# EAGLE design Cass2SD (EAGLE 8.3.1)
AUTOR: Bernd Strobel; PROJEKT: Cass2SD; VERSION: 1.0
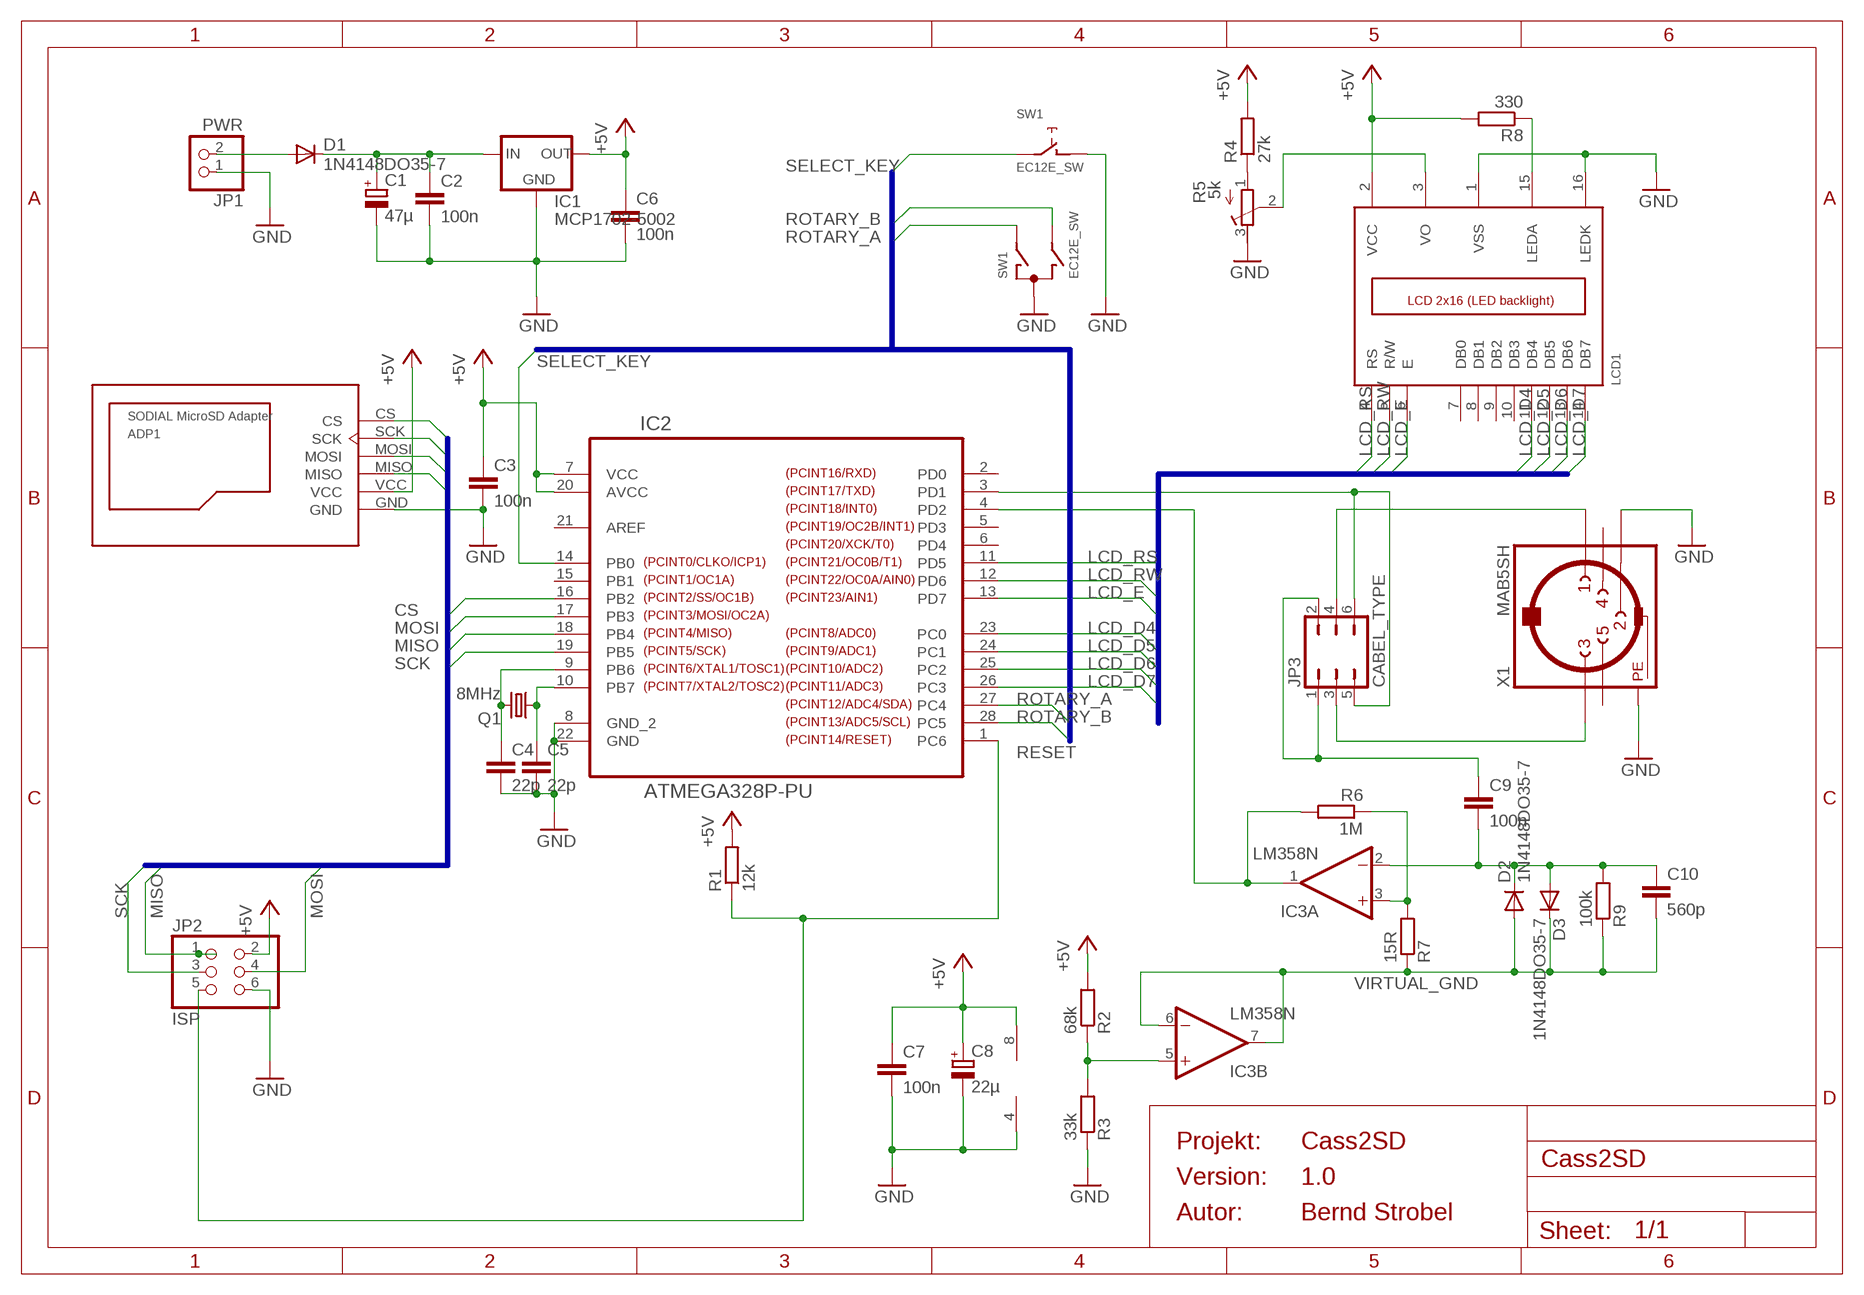
[diagram p0: schematic, sheet 1]

## Parts
ADP1  SODIAL_MICROSD_SPI_ADAPTER  [SODIAL_MICROSD_SPI_ADAPTER]
C1  47µ  CPOL-EUE2.5-7  [E2,5-7]
C2  100n  C-EU050-025X075  [C050-025X075]
C3  100n  C-EU050-025X075  [C050-025X075]
C4  22p  C-EU050-025X075  [C050-025X075]
C5  22p  C-EU050-025X075  [C050-025X075]
C6  100n  C-EU050-025X075  [C050-025X075]
C7  100n  C-EU050-025X075  [C050-025X075]
C8  22µ  CPOL-EUE2.5-7  [E2,5-7]
C9  100n  C-EU050-025X075  [C050-025X075]
C10  560p  C-EU050-025X075  [C050-025X075]
D1  1N4148DO35-7  [DO35-7]
D2  1N4148DO35-7  [DO35-7]
D3  1N4148DO35-7  [DO35-7]
IC1  MCP1702-5002  MCP1702  [TO92-]
IC2  ATMEGA328P-PU  [DIP254P762X457-28]
IC3  LM358N  [DIL08]
JP1  PWR  PINHD-1X2  [1X02]
JP2  ISP  PINHD-2X3  [2X03]
JP3  CABEL_TYPE  JP3Q  [JP3Q]
LCD1  LCD_2X16  [HY-1602F]
Q1  8MHz  CRYSTALHC49S  [HC49/S]
R1  12k  R-EU_0207/10  [0207/10]
R2  68k  R-EU_0207/10  [0207/10]
R3  33k  R-EU_0207/10  [0207/10]
R4  27k  R-EU_0207/10  [0207/10]
R5  5k  R-TRIMM64P  [RTRIM64P]
R6  1M  R-EU_0207/10  [0207/10]
R7  15R  R-EU_0207/10  [0207/10]
R8  330  R-EU_0207/10  [0207/10]
R9  100k  R-EU_0207/10  [0207/10]
SW1  EC12E_SW  [ALPS_EC12E_SW]
X1  MAB5SH  [MAB5SH]

## Nets
+5V: ADP1.VCC C3.1 C6.1 C7.1 C8.+ IC1.3(OUT) IC2.7(VCC) IC2.20(AVCC) IC3.8(P:V+) JP2.2 LCD1.2(VCC) R1.2 R2.2 R4.2 R8.2
CS: ADP1.CS IC2.16(PB2)
GND: ADP1.GND C1.- C2.2 C3.2 C4.2 C5.2 C6.2 C7.2 C8.- IC1.1(GND) IC2.8(GND_2) IC2.22(GND) IC3.4(P:V-) JP1.1 JP2.6 LCD1.1(VSS) LCD1.16(LEDK) R3.1 R5.3(E) SW1.C SW1.D X1.2 X1.PE X1.PE@(PE)
LCD_D4: IC2.23(PC0) LCD1.11(DB4)
LCD_D5: IC2.24(PC1) LCD1.12(DB5)
LCD_D6: IC2.25(PC2) LCD1.13(DB6)
LCD_D7: IC2.26(PC3) LCD1.14(DB7)
LCD_E: IC2.13(PD7) LCD1.6(E)
LCD_RS: IC2.11(PD5) LCD1.4(RS)
LCD_RW: IC2.12(PD6) LCD1.5(R/W)
MISO: ADP1.MISO IC2.18(PB4) JP2.1
MOSI: ADP1.MOSI IC2.17(PB3) JP2.4
N$1: C1.+ C2.1 D1.C IC1.2(IN)
N$2: C9.2 C10.1 D2.C D3.A IC3.2(A:-IN) R9.2
N$3: IC3.5(B:+IN) R2.1 R3.2
N$4: C4.1 IC2.9(PB6) Q1.2
N$5: C5.1 IC2.10(PB7) Q1.1
N$6: C9.1 JP3.1 JP3.2
N$7: IC3.3(A:+IN) R6.1 R7.2
N$8: IC2.4(PD2) IC3.1(A:OUT) R6.2
N$9: D1.A JP1.2
N$10: IC2.3(PD1) JP3.5 JP3.6
N$11: LCD1.15(LEDA) R8.1
N$12: JP3.3 X1.3
N$13: LCD1.3(VO) R5.2(S)
N$14: R4.1 R5.1(A)
N$16: JP3.4 X1.1
RESET: IC2.1(PC6) JP2.5 R1.1
ROTARY_A: IC2.27(PC4) SW1.A
ROTARY_B: IC2.28(PC5) SW1.B
SCK: ADP1.SCK IC2.19(PB5) JP2.3
SELECT_KEY: IC2.14(PB0) SW1.E
VIRTUAL_GND: C10.2 D2.A D3.C IC3.6(B:-IN) IC3.7(B:OUT) R7.1 R9.1
Unconnected: IC2.2(PD0) IC2.5(PD3) IC2.6(PD4) IC2.15(PB1) IC2.21(AREF) LCD1.7(DB0) LCD1.8(DB1) LCD1.9(DB2) LCD1.10(DB3) SW1.GND1(G) SW1.GND2(G) X1.4 X1.5

## Buses
BUS_DISP_DATA:LCD_D[4..7],LCD_RW,LCD_RS,LCD_E
ROTARY:SELECT_KEY,ROTARY_A,ROTARY_B
SPI:MOSI,MISO,SCK,CS

## Notes on the sheet
- Projekt:
- Version:
- Autor:

## Library data of the parts
ADP1 = BerndAdditionalSymbols:SODIAL_MICROSD_SPI_ADAPTER: SODIAL(R) SPI Reader for Micro SD Memory Cards
C1 C8 = resistor:CPOL-EU: POLARIZED CAPACITOR, European symbol
C2-C7 C9 C10 = resistor:C-EU: CAPACITOR, European symbol
D1-D3 = diode:1N4148: DIODE high speed (Philips)
IC1 = AdditionalSymbols:MCP1702: Adjustable Voltage Regulator, 1.2V to 37V, 100mA
IC2 = BerndAdditionalSymbols:ATMEGA328P-PU: 8-bit Microcontroller with In-System Programmable Flash; MPN: ATMEGA328P-PU; OC_FARNELL: 1715487; OC_NEWARK: 15R0268; PACKAGE: PDIP-28; SUPPLIER: Atmel
IC3 = linear:LM358: OP AMP also LM158; LM258; LM2904 Source: http://cache.national.com/ds/LM/LM158.pdf
JP1 = pinhead:PINHD-1X2: PIN HEADER
JP2 = pinhead:PINHD-2X3: PIN HEADER
JP3 = jumper:JP3Q: JUMPER
LCD1 = BerndAdditionalSymbols:LCD_2X16
Q1 = crystal:CRYSTAL: CRYSTAL; OC_FARNELL: 1667008; OC_NEWARK: unknown
R1-R4 R6-R9 = resistor:R-EU_: RESISTOR, European symbol
R5 = resistor:R-TRIMM: Trimm resistor
SW1 = switch-alps:EC12E_SW: ALPS rotary Encoder EC12E series with switch; MPN: EC12E2424407; OC_FARNELL: 1520813; OC_NEWARK: 74M1068
X1 = con-hirschmann:MAB5SH: Female CONNECTOR 5 pins 90 deg. with shield, horizontal (DIN 41524); OC_FARNELL: 809883; OC_NEWARK: unknown

## Board
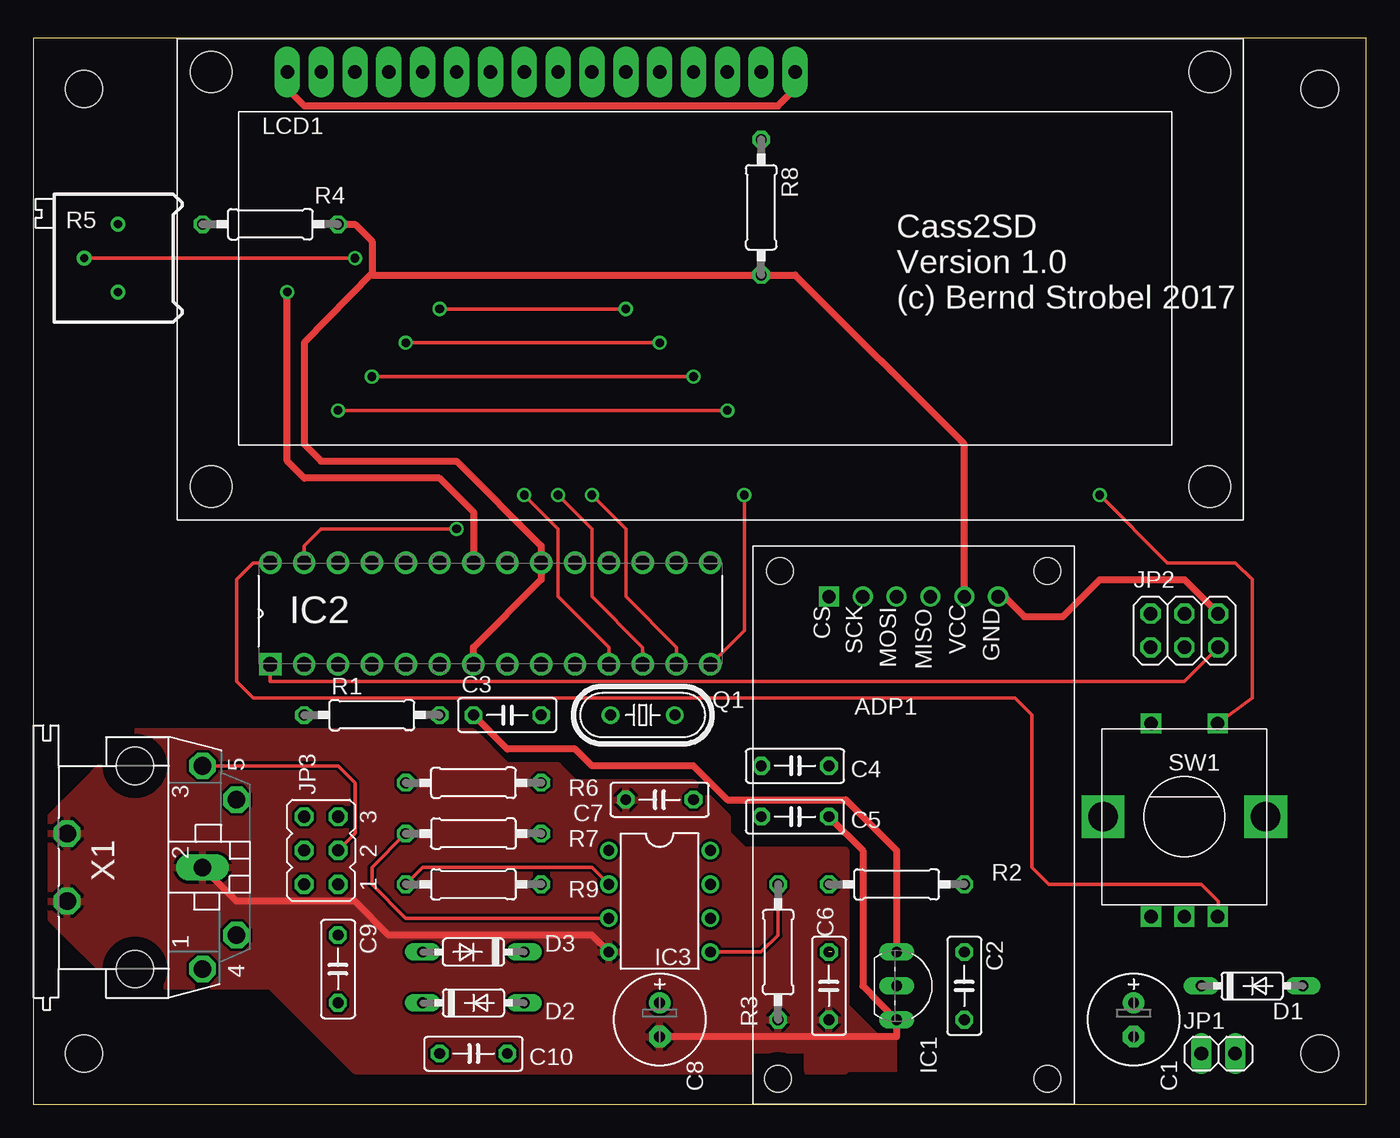
[diagram p1: board, top side]
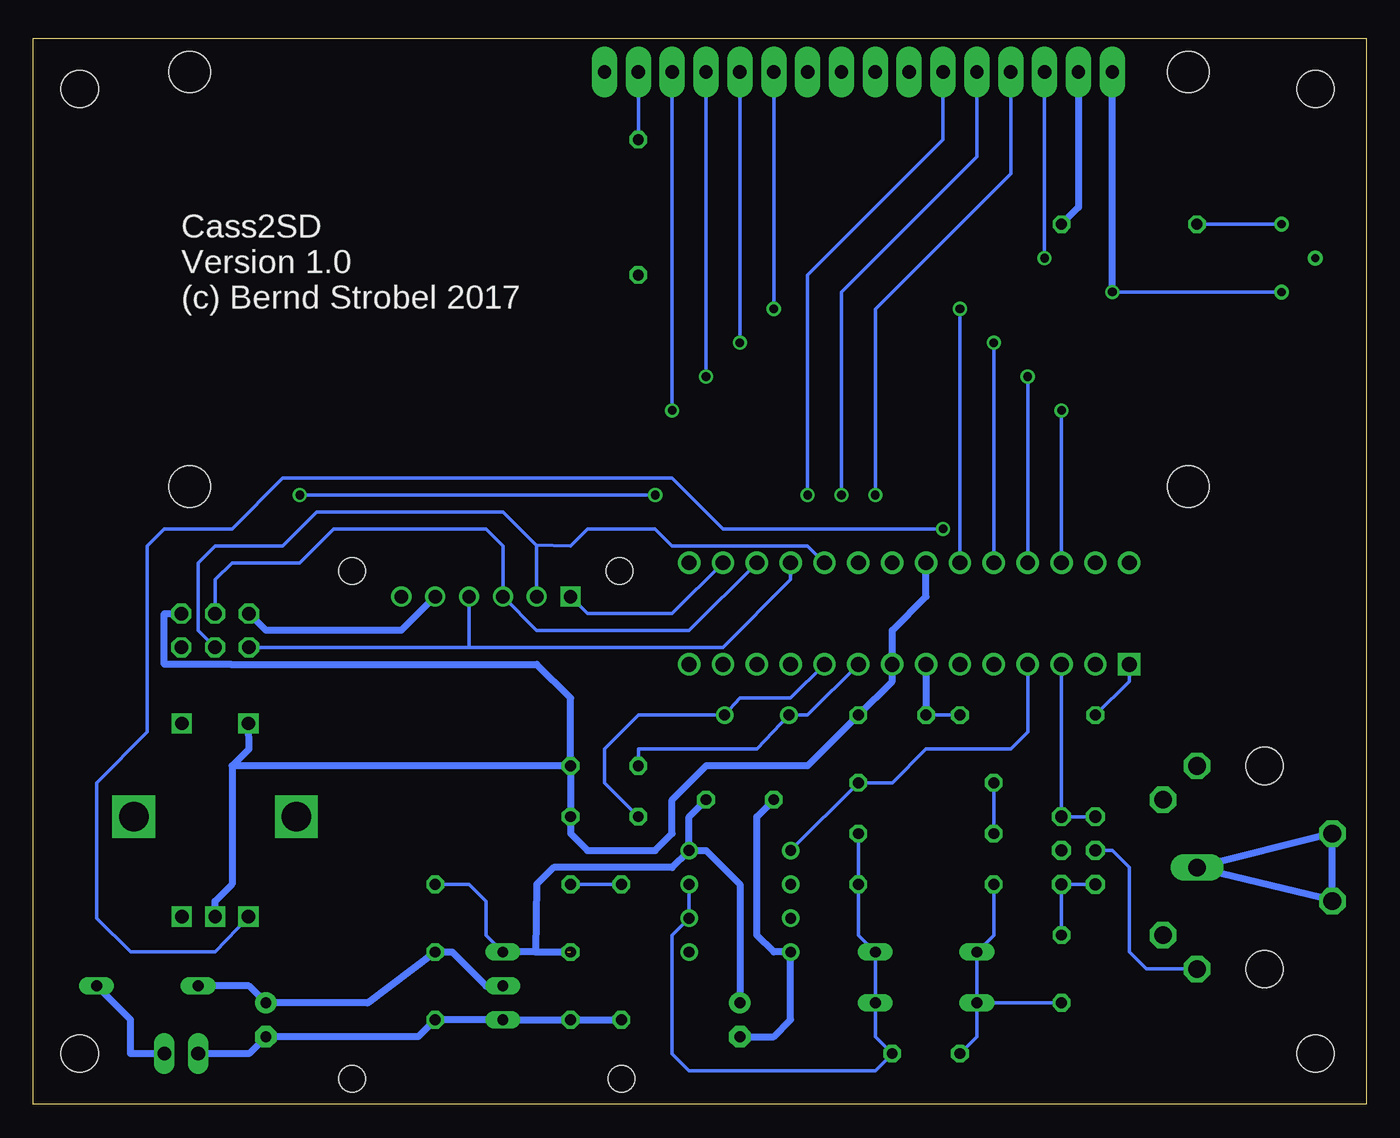
[diagram p2: board, bottom side, seen from below]

Size 100 x 80 mm. Coordinates in mm from the lower left corner, seen from the top.
Outline: 0,0 100,0 100,80 0,80 0,0
Copper layers (1*16): Top 0.035mm / dielectric 1.5mm / Bottom 0.035mm
Design rules "default": minimum track width 10mil, minimum drill 24mil, track to track 8mil, track to pad 8mil, pad to pad 8mil, via to via 8mil, smd to smd 8mil, copper to edge 40mil, drill to drill 8mil, minimum pad ring 10mil, minimum via ring 8mil, stop-mask expansion 4mil, vias tented up to drill 0mil, thermal gap 10mil
Holes 2.8 mm at 3.81,3.81 96.52,3.81 96.52,76.2 3.81,76.2

### Footprints (pad centres in the part's own frame; a part is rotated, then mirrored left to right if it is on the bottom)
SODIAL_MICROSD_SPI_ADAPTER = drill 1 square: CS 0,0 | drill 1: GND 12.7,0; MISO 7.62,0; MOSI 5.08,0; SCK 2.54,0; VCC 10.16,0 | hole 2: -3.683,1.905; 16.383,1.905; -3.81,-36.195; 16.383,-36.195
E2,5-7 = drill 0.813 pad 1.6: + -1.27,0 | drill 0.813 pad 1.6 octagon: - 1.27,0
C050-025X075 = drill 0.813 octagon: 1 -2.54,0; 2 2.54,0
DO35-7 = drill 0.813 long: A 3.81,0; C -3.81,0
TO92- = drill 0.813 long: 1 2.54,0; 2 0,0; 3 -2.54,0
DIP254P762X457-28 = drill 1.118 square: 1 0,0 | drill 1.118: 2 2.54,0; 3 5.08,0; 4 7.62,0; 5 10.16,0; 6 12.7,0; 7 15.24,0; 8 17.78,0; 9 20.32,0; 10 22.86,0; 11 25.4,0; 12 27.94,0; 13 30.48,0; 14 33.02,0; 15 33.02,7.62; 16 30.48,7.62; 17 27.94,7.62; 18 25.4,7.62; 19 22.86,7.62; 20 20.32,7.62; 21 17.78,7.62; 22 15.24,7.62; 23 12.7,7.62; 24 10.16,7.62; 25 7.62,7.62; 26 5.08,7.62; 27 2.54,7.62; 28 0,7.62
DIL08 = drill 0.813 pad 1.27: 1 -3.81,-3.81; 2 -1.27,-3.81; 3 1.27,-3.81; 4 3.81,-3.81; 5 3.81,3.81; 6 1.27,3.81; 7 -1.27,3.81; 8 -3.81,3.81
1X02 = drill 1.016 long: 1 -1.27,0; 2 1.27,0
2X03 = drill 1.016 octagon: 1 -2.54,-1.27; 2 -2.54,1.27; 3 0,-1.27; 4 0,1.27; 5 2.54,-1.27; 6 2.54,1.27
JP3Q = drill 0.914 octagon: 1 -2.54,-1.27; 2 -2.54,1.27; 3 0,-1.27; 4 0,1.27; 5 2.54,-1.27; 6 2.54,1.27
HY-1602F = drill 1 pad 1.93 long: 1 0,0; 2 2.54,0; 3 5.08,0; 4 7.62,0; 5 10.16,0; 6 12.7,0; 7 15.24,0; 8 17.78,0; 9 20.32,0; 10 22.86,0; 11 25.4,0; 12 27.94,0; 13 30.48,0; 14 33.02,0; 15 35.56,0; 16 38.1,0 | hole 3.11: -5.715,0; 69.215,0; -5.715,-31.115; 69.215,-31.115
HC49/S = drill 0.813: 1 -2.413,0; 2 2.413,0
0207/10 = drill 0.813 octagon: 1 -5.08,0; 2 5.08,0
RTRIM64P = drill 0.61: 1 0,-2.54; 2 2.54,0; 3 0,2.54
ALPS_EC12E_SW = drill 1 square: A -2.5,-7.5; B 2.5,-7.5; C 0,-7.5; D -2.5,7; E 2.5,7 | drill 2.2 square: GND1 -6.1,0; GND2 6.1,0
MAB5SH = drill 1.321 octagon: 1 7.62,5.08; 3 -7.62,5.08; 4 5.08,7.62; 5 -5.08,7.62; PE -2.54,-5.08; PE@ 2.54,-5.08 | drill 1.321 long: 2 0,5.08 | hole 2.794: 7.62,0; -7.62,0

### Placement (x,y rotation side)
ADP1  59.69,38.1 0 top
C1  82.55,6.35 270 top
C2  69.85,8.89 270 top
C3  35.56,29.21 0 top
C4  57.15,25.4 0 top
C5  57.15,21.59 0 top
C6  59.69,8.89 270 top
C7  46.99,22.86 180 top
C8  46.99,6.35 270 top
C9  22.86,10.16 270 top
C10  33.02,3.81 0 top
D1  91.44,8.89 0 top
D2  33.02,7.62 0 top
D3  33.02,11.43 180 top
IC1  64.77,8.89 270 top
IC2  17.78,33.02 0 top
IC3  46.99,15.24 270 top
JP1  88.9,3.81 0 top
JP2  86.36,35.56 0 top
JP3  21.59,19.05 90 top
LCD1  19.05,77.47 0 top
Q1  45.72,29.21 180 top
R1  25.4,29.21 0 top
R2  64.77,16.51 0 top
R3  55.88,11.43 90 top
R4  17.78,66.04 0 top
R5  6.35,63.5 180 top
R6  33.02,24.13 0 top
R7  33.02,20.32 180 top
R8  54.61,67.31 270 top
R9  33.02,16.51 180 top
SW1  86.36,21.59 0 top
X1  7.62,17.78 270 top

### Tracks (layer width: path | path; a pad name or v marks a point on that pad's centre or on a via)
+5V  (1 unrouted)
  Top 0.254: 25.4,62.23 25.4,62.38
  Top 0.508: 25.4,62.38 20.32,57.15 20.32,49.53 21.59,48.26 31.75,48.26 38.1,41.91 IC2.20 38.1,39.37 33.02,34.29 IC2.7 | C3.1 35.56,26.67 40.64,26.67 41.91,25.4 49.53,25.4 52.07,22.86 60.96,22.86 64.77,19.05 IC1.3 | ADP1.VCC 69.85,49.53 57.15,62.23 R8.2 25.4,62.23 25.4,64.77 24.13,66.04 R4.2
  Bottom 0.254: C3.1 R1.2 | 50.92,18.93 IC3.8 | IC1.3 66.04,12.7 66.04,15.24 67.31,16.51 R2.2
  Bottom 0.508: ADP1.VCC 72.39,35.56 82.55,35.56 JP2.2 | IC2.7 C3.1 | LCD1.2 21.59,67.31 R4.2 | 50.92,18.93 52.07,17.78 60.96,17.78 62.23,16.51 62.33,11.43 | 62.33,11.43 59.92,11.43 | 62.33,11.43 IC1.3 | C7.1 50.8,21.59 IC3.8 49.53,19.05 46.99,16.51 C8.+
CS
  Bottom 0.254: IC2.16 52.07,36.83 58.42,36.83 ADP1.CS
GND  (via drill 0.65)
  Top 0.254: 64.77,6.29 IC1.1
  Top 0.508: C8.- 64.77,5.08 64.77,6.29 62.23,8.89 62.23,19.05 C5.2 | IC3.4 41.91,12.7 26.67,12.7 24.13,15.24 15.24,15.24 X1.2 | LCD1.1 19.05,76.2 20.32,74.93 55.88,74.93 57.15,76.2 LCD1.16 | IC2.22 33.02,44.45 30.48,46.99 20.32,46.99 19.05,48.26 v19.05,60.96 | ADP1.GND 72.84,38.1 74.35,36.59 77.23,36.59 80.01,39.37 86.36,39.37 JP2.6
  Bottom 0.152: 85.18,33.02 85.09,33.02
  Bottom 0.254: 41.7,25.61 41.91,25.4 | R5.3 v19.05,60.96
  Bottom 0.508: JP2.6 90.17,36.83 90.17,33.02 85.18,33.02 62.23,33.02 59.69,30.48 C4.2 | C3.2 | C4.2 C5.2 59.69,20.32 58.42,19.05 53.34,19.05 52.07,20.32 52.07,22.86 49.53,25.4 41.91,25.4 C3.2 | 2.54,15.33 X1.PE@ | 2.54,15.33 X1.PE X1.2 2.54,15.33 | R3.1 C6.2 IC1.1 C2.2 71.12,5.08 C1.- 83.82,3.81 JP1.1 | v19.05,60.96 LCD1.1 | C7.2 45.72,21.59 45.72,12.7 44.45,11.43 IC3.4 43.18,6.35 44.45,5.08 C8.- | SW1.C 86.36,15.24 85.09,16.51 85.09,25.4 | 85.09,25.4 83.82,26.67 SW1.D | C4.2 85.09,25.4 | IC2.22 33.02,38.1 35.56,35.56 IC2.8 35.56,31.75 C3.2
  pour Top: 60.96,2.54 64.77,2.54 64.77,5.08 63.5,5.08 60.96,7.62
  pour Top: 60.96,2.54 60.96,19.05 53.34,19.05 52.07,20.32 52.07,21.59 49.53,24.13 40.64,24.13 39.37,25.4 35.56,25.4 33.02,27.94 7.62,27.94 1.27,21.59 1.27,13.97 6.35,8.89 17.78,8.89 24.13,2.54
LCD_D4  (via drill 0.65)
  Top 0.254: v44.45,59.69 v30.48,59.69
  Bottom 0.254: LCD1.11 v44.45,59.69 | v30.48,59.69 IC2.23
LCD_D5  (via drill 0.65)
  Top 0.254: v27.94,57.15 v46.99,57.15
  Bottom 0.254: IC2.24 v27.94,57.15 | v46.99,57.15 LCD1.12
LCD_D6  (via drill 0.65)
  Top 0.254: v49.53,54.61 v25.4,54.61
  Bottom 0.254: LCD1.13 v49.53,54.61 | v25.4,54.61 IC2.25
LCD_D7  (via drill 0.65)
  Top 0.254: v22.86,52.07 v52.07,52.07
  Bottom 0.254: IC2.26 v22.86,52.07 | v52.07,52.07 LCD1.14
LCD_E  (via drill 0.65)
  Top 0.254: IC2.13 48.26,34.29 44.45,38.1 44.45,43.18 v41.91,45.72
  Bottom 0.254: LCD1.6 31.75,72.39 41.91,62.23 v41.91,45.72
LCD_RS  (via drill 0.65)
  Top 0.254: IC2.11 43.18,34.29 39.37,38.1 39.37,43.18 v36.83,45.72
  Bottom 0.254: LCD1.4 26.67,69.85 36.83,59.69 v36.83,45.72
LCD_RW  (via drill 0.65)
  Top 0.254: IC2.12 45.72,34.29 41.91,38.1 41.91,43.18 v39.37,45.72
  Bottom 0.152: 39.37,46.99 39.37,46.38
  Bottom 0.254: LCD1.5 29.21,71.12 39.37,60.96 39.37,46.99 v39.37,45.72
MISO  (1 unrouted)
  Bottom 0.254: IC2.18 43.18,39.37 48.26,34.29 67.31,34.29 ADP1.MISO | JP2.1 68.58,34.29 67.32,34.3
MOSI
  Bottom 0.254: IC2.17 50.8,35.56 62.23,35.56 ADP1.MOSI 64.77,41.91 66.04,43.18 77.47,43.18 80.01,40.64 85.09,40.64 86.36,39.37 JP2.4
N$1
  Bottom 0.508: IC1.2 66.04,8.89 68.58,11.43 C2.1 74.93,7.62 C1.+ 83.82,8.89 D1.C
N$2
  Top 0.254: IC3.2 41.91,17.78 29.21,17.78 R9.2
  Bottom 0.254: D2.C D3.A 27.94,12.7 R9.2 | D2.C C9.2 | C10.1 29.21,5.08 D2.C
N$3
  Top 0.254: IC3.5 54.61,11.43 55.88,12.7 R3.2
  Bottom 0.254: R2.1 R3.2
N$4
  Bottom 0.254: C4.1 54.61,26.67 45.72,26.67 Q1.2 41.91,29.21 IC2.9
N$5
  Bottom 0.254: C5.1 57.15,24.13 57.15,26.67 54.61,29.21 Q1.1 46.99,30.48 43.18,30.48 IC2.10
N$6
  Bottom 0.254: C9.1 JP3.1 JP3.2
N$7
  Top 0.254: IC3.3 27.94,13.97 25.4,16.51 25.4,17.78 R7.2
  Bottom 0.254: R6.1 R7.2
N$8
  Bottom 0.254: IC3.1 R6.2 35.56,24.13 33.02,26.67 26.67,26.67 25.4,27.94 IC2.4
N$9
  Bottom 0.508: JP1.2 92.71,3.81 92.71,6.35 D1.A
N$10
  Bottom 0.254: JP3.6 JP3.5 IC2.3
N$11
  Bottom 0.254: LCD1.15 R8.1
N$12
  Top 0.254: JP3.3 24.13,20.32 24.13,24.13 22.86,25.4 X1.3
N$13  (via drill 0.65)
  Top 0.254: R5.2 v24.13,63.5
  Bottom 0.254: v24.13,63.5 LCD1.3
N$14
  Bottom 0.254: R5.1 R4.1
N$16
  Bottom 0.254: JP3.4 19.05,19.05 17.78,17.78 17.78,11.43 16.51,10.16 X1.1
RESET
  Top 0.254: JP2.5 86.36,31.75 17.78,31.75 IC2.1
  Bottom 0.254: R1.1 17.78,31.75 IC2.1
ROTARY_A  (via drill 0.65)
  Top 0.254: v31.75,43.18 21.59,43.18 20.32,41.91 IC2.27
  Bottom 0.254: v31.75,43.18 48.26,43.18 52.07,46.99 81.28,46.99 85.09,43.18 90.17,43.18 91.44,41.91 91.44,27.94 95.25,24.13 95.25,13.97 92.71,11.43 86.36,11.43 SW1.A
ROTARY_B
  Top 0.254: SW1.B 88.9,15.24 87.63,16.51 76.2,16.51 74.93,17.78 74.93,29.21 73.66,30.48 16.51,30.48 15.24,31.75 15.24,39.37 16.51,40.64 IC2.28
SCK
  Bottom 0.254: IC2.19 41.91,41.91 52.07,41.91 53.34,43.18 58.42,43.18 59.69,41.91 62.28,41.97 | ADP1.SCK 62.23,41.91 62.28,41.97 | JP2.3 87.63,35.56 87.63,40.64 86.36,41.91 81.28,41.91 78.74,44.45 64.77,44.45 62.28,41.97
SELECT_KEY  (via drill 0.65)
  Top 0.254: SW1.E 91.44,30.48 91.44,39.37 90.17,40.64 85.09,40.64 v80.01,45.72 | v53.34,45.72 53.34,35.56 IC2.14
  Bottom 0.254: v80.01,45.72 v53.34,45.72
VIRTUAL_GND
  Bottom 0.254: IC3.7 IC3.6 52.07,12.7 52.07,3.81 50.8,2.54 36.83,2.54 C10.2 36.83,5.08 36.83,7.87 | 36.83,7.87 D2.A | 36.83,7.87 D3.C 38.1,12.7 R9.1 R7.1

### Text on the board
tPlace: Cass2SD / Version 1.0 / (c) Bernd Strobel 2017
bPlace: Cass2SD / Version 1.0 / (c) Bernd Strobel 2017